# Altium schematic sheet EMI_HV_Protect.SchDoc
size A; SheetNumber: 4; SheetTotal: 4
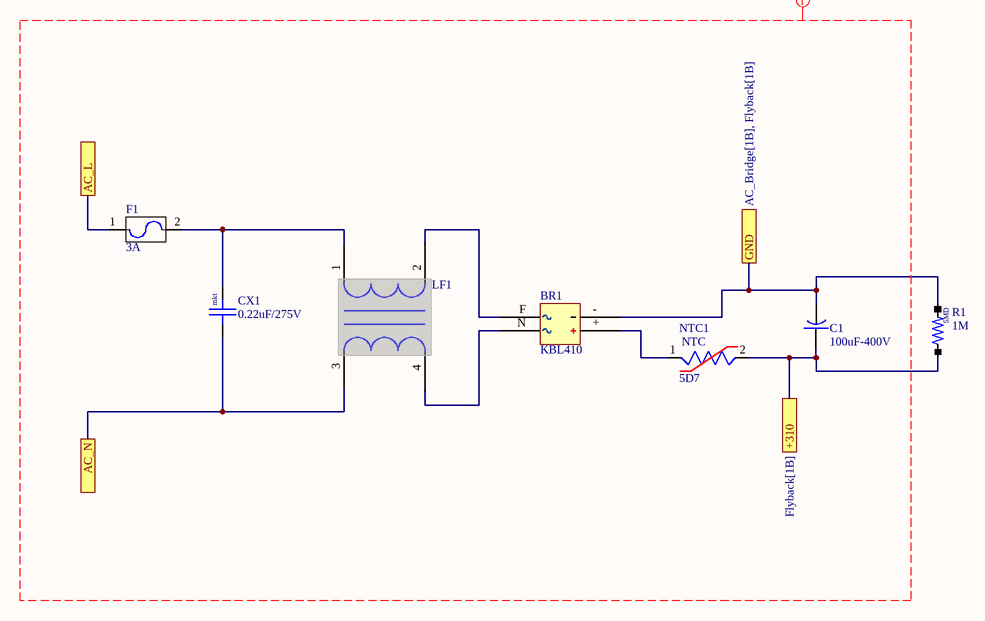
[diagram p0: EMI_HV_Protect.SchDoc]

## Parts
BR1  KBL410  [KBP206]
C1  100uF-400V  [CAP-EL-P7MM]
CX1  0.22uF/275V  [CAP/0.22uF/275v/mkt]
F1  3A  [FUZE_GLASS_ISTADE]
LF1  (no value)  [emi_chok_yd]
NTC1  5D7  [NTC_XD_7]
R1  1M  [RES/1206]

## Ports
+310 (see Flyback[1B]), AC_L, AC_N, GND (see AC_Bridge[1B], Flyback[1B])

## Nets
+310: C1.+ NTC1.2 R1.1 ; port +310
AC_L: F1.1 ; port AC_L
AC_N: CX1.1 LF1.3 ; port AC_N
GND: BR1.- C1.- R1.2 ; port GND
NetBR1_+: BR1.+ NTC1.1
NetBR1_F: BR1.F LF1.2
NetBR1_N: BR1.N LF1.4
NetCX1_2: CX1.2 F1.2 LF1.1

## Layout directives
net class PP300V: (no net found under the mark)

## Notes on the sheet
- (in symbol cap-mkt) mkt
- (in symbol RES/SMD) SMD

## Library data of the parts
BR1 = BRIDGE RECTIFIERS
C1 = cap-electrolit
CX1 = cap-mkt
F1 = fuze
LF1 = emi_chok_yd
NTC1 = NTC
R1 = RES/SMD